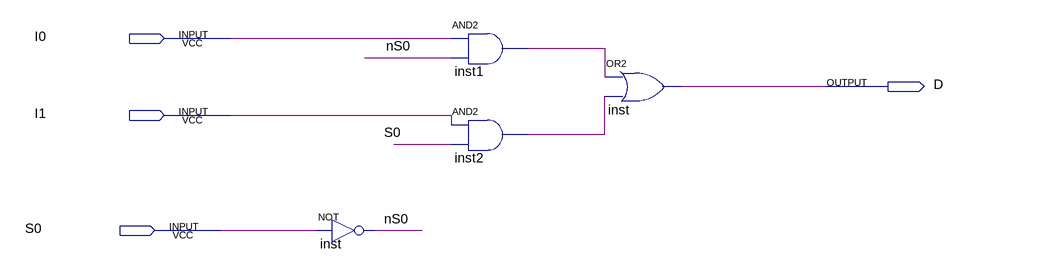
[diagram p0: schematic sheet]
// Quartus schematic MojMX2.bdf as structural Verilog: 4 symbols, 4 pins
module MojMX2 (
  input  I0,
  input  I1,
  input  S0,
  output D
);

  wire inst1_out, inst2_out, nS0;

  not inst (nS0, S0);
  and inst1 (inst1_out, I0, nS0);
  and inst2 (inst2_out, I1, S0);
  or inst_dup2 (D, inst1_out, inst2_out);
endmodule
